# Altium schematic sheet _klt-j4k-ov2732.SchDoc
size Tabloid
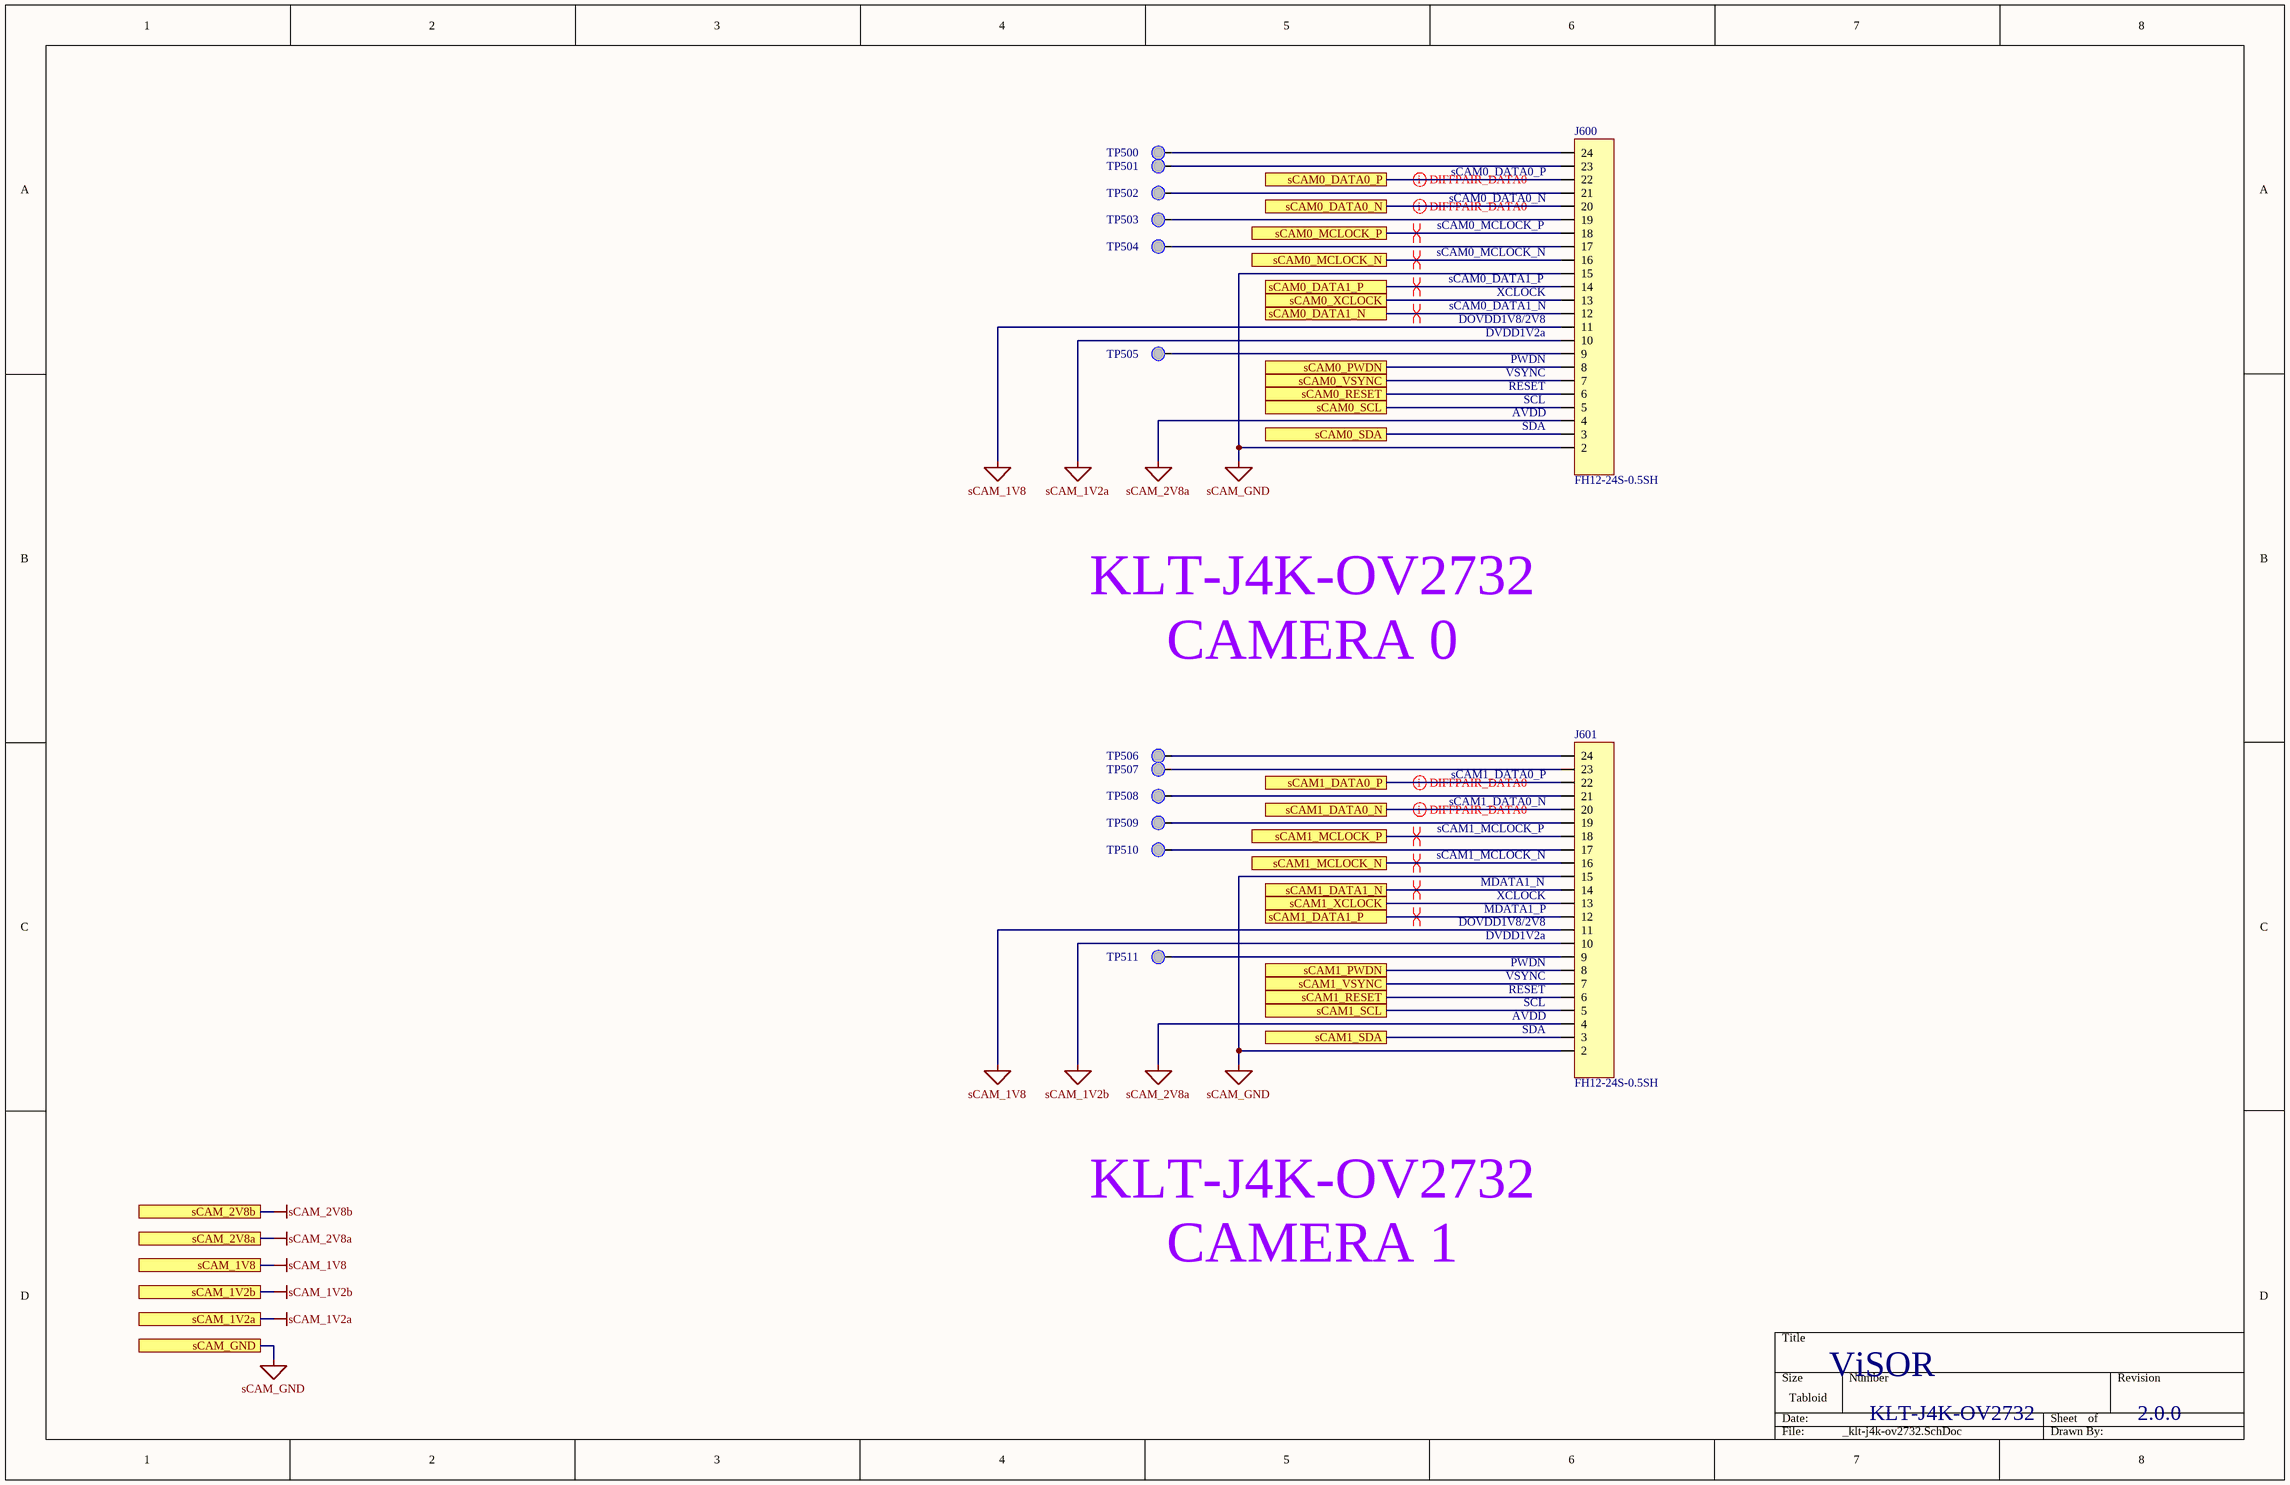
[diagram p0: _klt-j4k-ov2732.SchDoc]

## Parts
J600  FH12-24S-0.5SH  [FH12-24S-0.5SH]
J601  FH12-24S-0.5SH  [FH12-24S-0.5SH]
TP500  TP  [TP_TH]  (value not drawn)
TP501  TP  [TP_TH]  (value not drawn)
TP502  TP  [TP_TH]  (value not drawn)
TP503  TP  [TP_TH]  (value not drawn)
TP504  TP  [TP_TH]  (value not drawn)
TP505  TP  [TP_TH]  (value not drawn)
TP506  TP  [TP_TH]  (value not drawn)
TP507  TP  [TP_TH]  (value not drawn)
TP508  TP  [TP_TH]  (value not drawn)
TP509  TP  [TP_TH]  (value not drawn)
TP510  TP  [TP_TH]  (value not drawn)
TP511  TP  [TP_TH]  (value not drawn)

## Ports
sCAM0_DATA0_N, sCAM0_DATA0_P, sCAM0_DATA1_N, sCAM0_DATA1_P, sCAM0_MCLOCK_N, sCAM0_MCLOCK_P, sCAM0_PWDN, sCAM0_RESET, sCAM0_SCL, sCAM0_SDA, sCAM0_VSYNC, sCAM0_XCLOCK, sCAM1_DATA0_N, sCAM1_DATA0_P, sCAM1_DATA1_N, sCAM1_DATA1_P, sCAM1_MCLOCK_N, sCAM1_MCLOCK_P, sCAM1_PWDN, sCAM1_RESET, sCAM1_SCL, sCAM1_SDA, sCAM1_VSYNC, sCAM1_XCLOCK, sCAM_1V2a, sCAM_1V2b, sCAM_1V8, sCAM_2V8a, sCAM_2V8b, sCAM_GND

## Nets
sCAM_1V2a: J600.10 ; port sCAM_1V2a
sCAM_1V2b: J601.10 ; port sCAM_1V2b
sCAM_1V8: J600.11 J601.11 ; port sCAM_1V8
sCAM_2V8a: J600.4 J601.4 ; port sCAM_2V8a
sCAM_2V8b: port sCAM_2V8b
sCAM_GND: J600.2 J600.15 J601.2 J601.15 ; port sCAM_GND
sCAM0_DATA0_N: J600.20 ; port sCAM0_DATA0_N
sCAM0_DATA0_P: J600.22 ; port sCAM0_DATA0_P
sCAM0_DATA1_N: J600.12 ; port sCAM0_DATA1_N
sCAM0_DATA1_P: J600.14 ; port sCAM0_DATA1_P
sCAM0_MCLOCK_N: J600.16 ; port sCAM0_MCLOCK_N
sCAM0_MCLOCK_P: J600.18 ; port sCAM0_MCLOCK_P
sCAM0_PWDN: J600.8 ; port sCAM0_PWDN
sCAM0_RESET: J600.6 ; port sCAM0_RESET
sCAM0_SCL: J600.5 ; port sCAM0_SCL
sCAM0_SDA: J600.3 ; port sCAM0_SDA
sCAM0_VSYNC: J600.7 ; port sCAM0_VSYNC
sCAM0_XCLOCK: J600.13 ; port sCAM0_XCLOCK
sCAM1_DATA0_N: J601.20 ; port sCAM1_DATA0_N
sCAM1_DATA0_P: J601.22 ; port sCAM1_DATA0_P
sCAM1_DATA1_N: J601.14 ; port sCAM1_DATA1_N
sCAM1_DATA1_P: J601.12 ; port sCAM1_DATA1_P
sCAM1_MCLOCK_N: J601.16 ; port sCAM1_MCLOCK_N
sCAM1_MCLOCK_P: J601.18 ; port sCAM1_MCLOCK_P
sCAM1_PWDN: J601.8 ; port sCAM1_PWDN
sCAM1_RESET: J601.6 ; port sCAM1_RESET
sCAM1_SCL: J601.5 ; port sCAM1_SCL
sCAM1_SDA: J601.3 ; port sCAM1_SDA
sCAM1_VSYNC: J601.7 ; port sCAM1_VSYNC
sCAM1_XCLOCK: J601.13 ; port sCAM1_XCLOCK
NetJ600_9: J600.9 TP505.1
NetJ600_17: J600.17 TP504.1
NetJ600_19: J600.19 TP503.1
NetJ600_21: J600.21 TP502.1
NetJ600_23: J600.23 TP501.1
NetJ600_24: J600.24 TP500.1
NetJ601_9: J601.9 TP511.1
NetJ601_17: J601.17 TP510.1
NetJ601_19: J601.19 TP509.1
NetJ601_21: J601.21 TP508.1
NetJ601_23: J601.23 TP507.1
NetJ601_24: J601.24 TP506.1

Not connected (* = marked no-connect by the designer): J600 1; J601 1

## Layout directives
differential pair: sCAM0_DATA0_N, sCAM0_DATA0_P, sCAM0_DATA1_N, sCAM0_DATA1_P, sCAM0_MCLOCK_N, sCAM0_MCLOCK_P, sCAM1_DATA0_N, sCAM1_DATA0_P, sCAM1_DATA1_N, sCAM1_DATA1_P, sCAM1_MCLOCK_N, sCAM1_MCLOCK_P

## Notes on the sheet
- (near J600) XCLOCK
- (near J600) DVDD1V2a
- (near J600) DOVDD1V8/2V8
- (near J600) PWDN
- (near J600) AVDD
- (near J600) SDA
- (near J600) SCL
- (near J600) RESET
- (near J600) VSYNC
- KLT-J4K-OV2732
  CAMERA 0
- (near J601) MDATA1_N
- (near J601) XCLOCK
- (near J601) DVDD1V2a
- (near J601) DOVDD1V8/2V8
- (near J601) MDATA1_P
- (near J601) PWDN
- (near J601) AVDD
- (near J601) SDA
- (near J601) SCL
- (near J601) RESET
- (near J601) VSYNC
- KLT-J4K-OV2732
  CAMERA 1
- ViSOR
- KLT-J4K-OV2732
- 2.0.0

## Library data of the parts
J600 J601 = FH12-24S-0.5SH: ONN FFC BOTTOM 24POS 0.50MM R/A